# EAGLE design turbo_B (EAGLE 6.5.0)

## Sheet 1 of 3: Shield
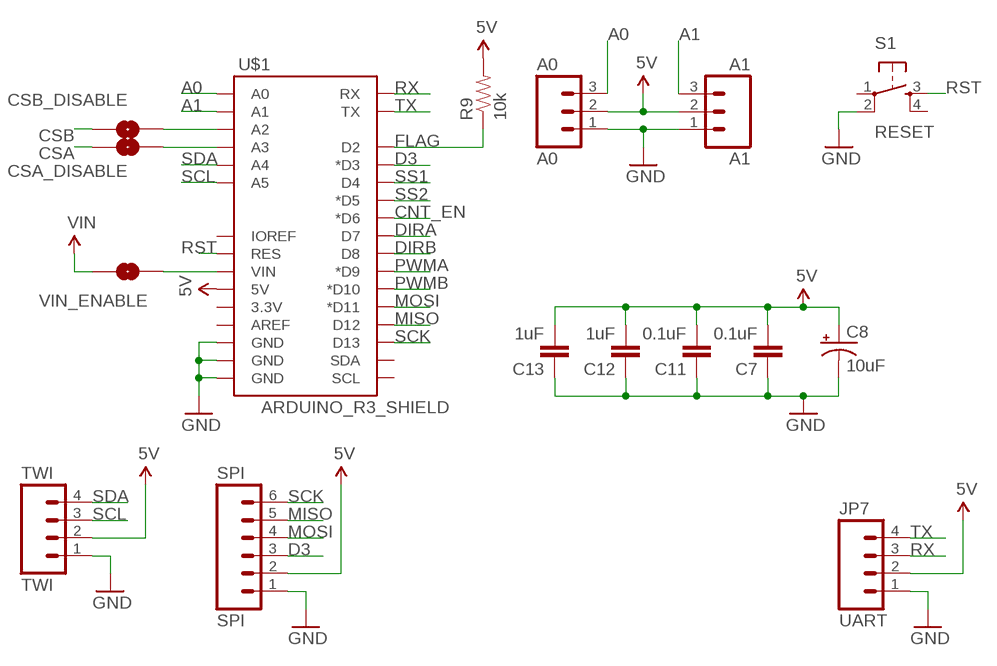
[diagram p0: schematic, sheet 1]

### Parts
A0  A0  M03LOCK  [1X03_LOCK]
A1  A1  M03LOCK  [1X03_LOCK]
C7  0.1uF  CAP0603-CAP  [0603-CAP]
C8  10uF  CAP_POLC  [PANASONIC_C]
C11  0.1uF  CAP0603-CAP  [0603-CAP]
C12  1uF  CAP0603-CAP  [0603-CAP]
C13  1uF  CAP0603-CAP  [0603-CAP]
CSA_DISABLE  SOLDERJUMPERTRACE  [SJ_2S-TRACE]
CSB_DISABLE  SOLDERJUMPERTRACE  [SJ_2S-TRACE]
JP7  UART  M04LOCK  [1X04_LOCK]
R9  10k  RESISTOR0603-RES  [0603-RES]
S1  RESET  TAC_SWITCHSMD  [TACTILE_SWITCH_SMD]
SPI  SPI  M06LOCK  [1X06_LOCK]
TWI  TWI  M04LOCK  [1X04_LOCK]
U$1  ARDUINO_R3_SHIELD  [UNO_R3_SHIELD]
VIN_ENABLE  SOLDERJUMPERNO  [SJ_2S-NO]

### Nets
5V: A0.2 A1.2 C7.2 C8.+ C11.2 C12.2 C13.2 JP7.2 R9.2 SPI.2 TWI.2 U$1.5V ; also sheet 2,3
A0: A0.3 U$1.A0
A1: A1.3 U$1.A1
CNT_EN: U$1.D6(*D6) ; also sheet 2
CSA: CSA_DISABLE.2 ; also sheet 3
CSB: CSB_DISABLE.2 ; also sheet 3
D3: SPI.3 U$1.D3(*D3)
DIRA: U$1.D7 ; also sheet 3
DIRB: U$1.D8 ; also sheet 3
FLAG: R9.1 U$1.D2 ; also sheet 2
GND: A0.1 A1.1 C7.1 C8.- C11.1 C12.1 C13.1 JP7.1 S1.2 SPI.1 TWI.1 U$1.GND@0(GND) U$1.GND@1(GND) U$1.GND@2(GND) ; also sheet 2,3
MISO: SPI.5 U$1.D12 ; also sheet 2
MOSI: SPI.4 U$1.D11(*D11) ; also sheet 2
N$7: CSB_DISABLE.1 U$1.A2
N$11: CSA_DISABLE.1 U$1.A3
N$13: U$1.VIN VIN_ENABLE.2
PWMA: U$1.D9(*D9) ; also sheet 3
PWMB: U$1.D10(*D10) ; also sheet 3
RST: S1.3 U$1.RES
RX: JP7.3 U$1.RX
SCK: SPI.6 U$1.D13 ; also sheet 2
SCL: TWI.3 U$1.A5
SDA: TWI.4 U$1.A4
SS1: U$1.D4 ; also sheet 2
SS2: U$1.D5(*D5) ; also sheet 2
TX: JP7.4 U$1.TX
VIN: VIN_ENABLE.1 ; also sheet 3
Unconnected: S1.1 S1.4 U$1.3.3V U$1.AREF U$1.IOREF U$1.SCL U$1.SDA

## Sheet 2 of 3: Encoder Counters
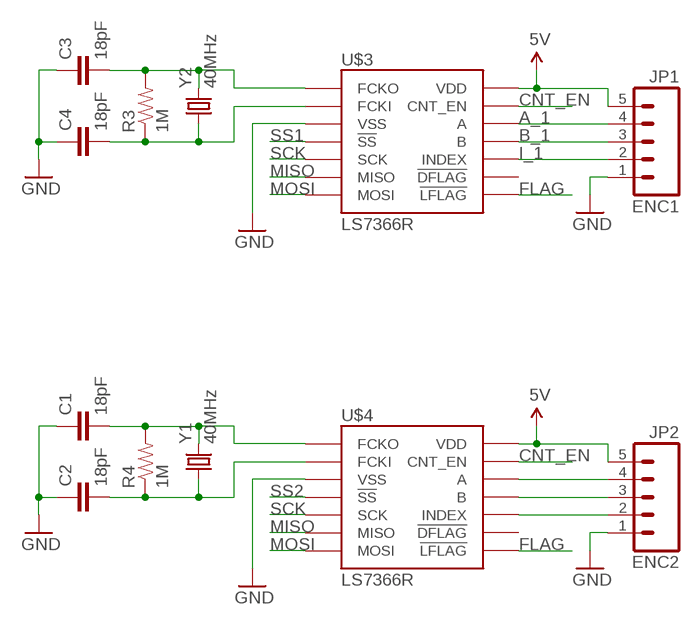
[diagram p1: schematic, sheet 2]

### Parts
C1  18pF  CAP0603-CAP  [0603-CAP]
C2  18pF  CAP0603-CAP  [0603-CAP]
C3  18pF  CAP0603-CAP  [0603-CAP]
C4  18pF  CAP0603-CAP  [0603-CAP]
JP1  ENC1  M05LOCK  [1X05_LOCK]
JP2  ENC2  M05LOCK  [1X05_LOCK]
R3  1M  RESISTOR0603-RES  [0603-RES]
R4  1M  RESISTOR0603-RES  [0603-RES]
U$3  LS7366R  [SOIC14]
U$4  LS7366R  [SOIC14]
Y1  40MHz  CRYSTAL5X3  [CRYSTAL-SMD-5X3]
Y2  40MHz  CRYSTAL5X3  [CRYSTAL-SMD-5X3]

### Nets
5V: JP1.5 JP2.5 U$3.14(VDD) U$4.14(VDD) ; also sheet 1,3
A_1: JP1.4 U$3.12(A)
B_1: JP1.3 U$3.11(B)
CNT_EN: U$3.13(CNT_EN) U$4.13(CNT_EN) ; also sheet 1
FLAG: U$3.8(!LFLAG) U$4.8(!LFLAG) ; also sheet 1
GND: C1.1 C2.1 C3.1 C4.1 JP1.1 JP2.1 U$3.3(VSS) U$4.3(VSS) ; also sheet 1,3
I_1: JP1.2 U$3.10(INDEX)
MISO: U$3.6(MISO) U$4.6(MISO) ; also sheet 1
MOSI: U$3.7(MOSI) U$4.7(MOSI) ; also sheet 1
N$1: C3.2 R3.2 U$3.1(FCKO) Y2.3
N$2: C4.2 R3.1 U$3.2(FCKI) Y2.1
N$3: JP2.4 U$4.12(A)
N$4: JP2.3 U$4.11(B)
N$5: JP2.2 U$4.10(INDEX)
N$9: C1.2 R4.2 U$4.1(FCKO) Y1.3
N$10: C2.2 R4.1 U$4.2(FCKI) Y1.1
SCK: U$3.5(SCK) U$4.5(SCK) ; also sheet 1
SS1: U$3.4(!SS) ; also sheet 1
SS2: U$4.4(!SS) ; also sheet 1
Unconnected: U$3.9(!DFLAG) U$4.9(!DFLAG)

## Sheet 3 of 3: Motor Driver
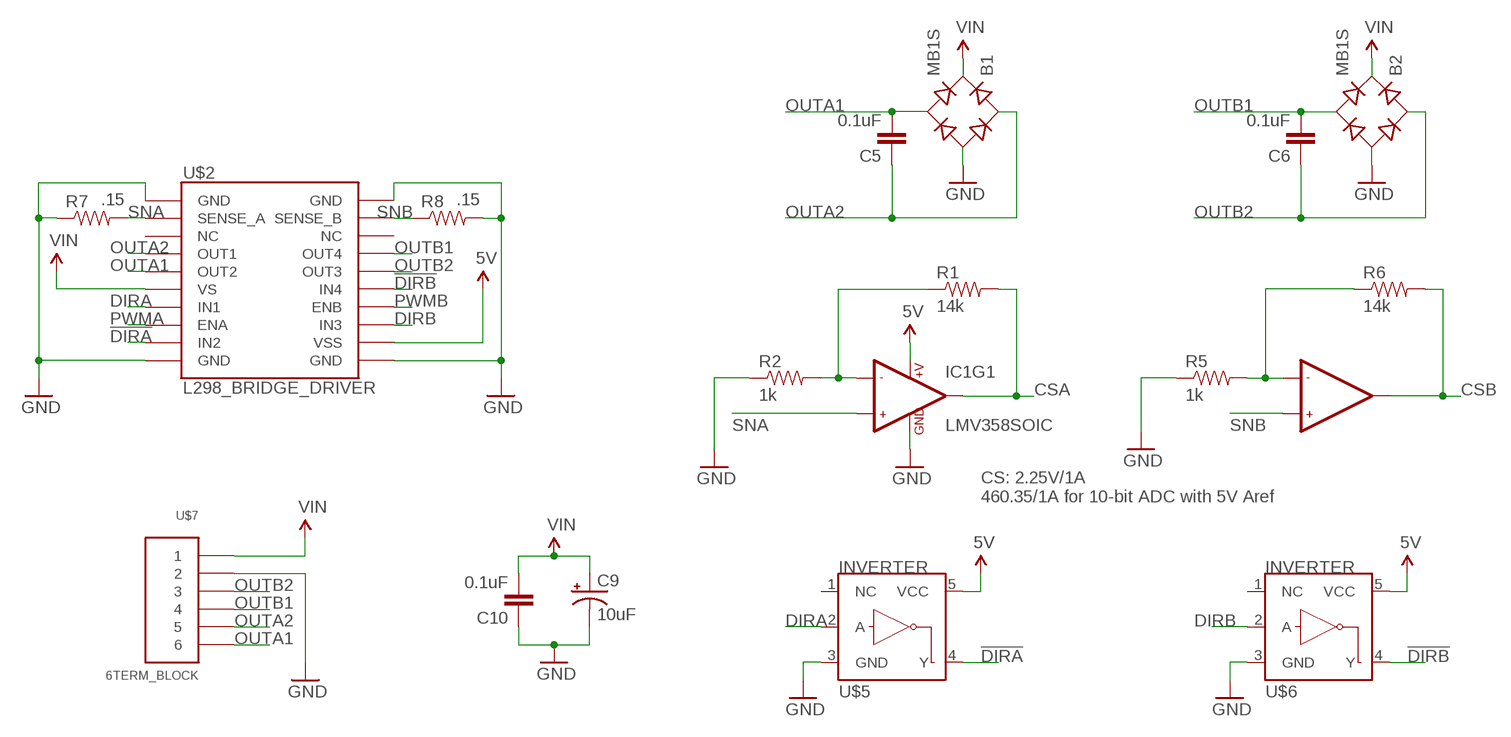
[diagram p2: schematic, sheet 3]

### Parts
B1  MB1S  [SOIC-4]
B2  MB1S  [SOIC-4]
C5  0.1uF  CAP0603-CAP  [0603-CAP]
C6  0.1uF  CAP0603-CAP  [0603-CAP]
C9  10uF  CAP_POLC  [PANASONIC_C]
C10  0.1uF  CAP0603-CAP  [0603-CAP]
IC1  LMV358SOIC  [SO08]
R1  14k  RESISTOR0603-RES  [0603-RES]
R2  1k  RESISTOR0603-RES  [0603-RES]
R5  1k  RESISTOR0603-RES  [0603-RES]
R6  14k  RESISTOR0603-RES  [0603-RES]
R7  .15  RESISTOR1206  [1206]
R8  .15  RESISTOR1206  [1206]
U$2  L298_BRIDGE_DRIVER  [POWERSO20]
U$5  INVERTER  [SOT23-5]
U$6  INVERTER  [SOT23-5]
U$7  6TERM_BLOCK  [6TERM_BLOCK]

### Nets
5V: IC1.8(+V) U$2.12(VSS) U$5.5(VCC) U$6.5(VCC) ; also sheet 1,2
!DIRA: U$2.9(IN2) U$5.4(Y)
!DIRB: U$2.15(IN4) U$6.4(Y)
CSA: IC1.1(OUT1) R1.2 ; also sheet 1
CSB: IC1.7(OUT2) R6.2 ; also sheet 1
DIRA: U$2.7(IN1) U$5.2(A) ; also sheet 1
DIRB: U$2.13(IN3) U$6.2(A) ; also sheet 1
GND: B1.- B2.- C9.- C10.1 IC1.4(GND) R2.1 R5.1 R7.1 R8.2 U$2.1(GND) U$2.10(GND) U$2.11(GND) U$2.20(GND) U$2.P$1(GND) U$5.3(GND) U$6.3(GND) U$7.P$2 ; also sheet 1,2
N$6: IC1.6(-IN2) R5.2 R6.1
N$12: IC1.2(-IN1) R1.1 R2.2
OUTA1: B1.~2(AC2) C5.2 U$2.5(OUT2) U$7.P$6
OUTA2: B1.~1(AC1) C5.1 U$2.4(OUT1) U$7.P$5
OUTB1: B2.~2(AC2) C6.2 U$2.17(OUT4) U$7.P$4
OUTB2: B2.~1(AC1) C6.1 U$2.16(OUT3) U$7.P$3
PWMA: U$2.8(ENA) ; also sheet 1
PWMB: U$2.14(ENB) ; also sheet 1
SNA: IC1.3(+IN1) R7.2 U$2.2(SENSE_A)
SNB: IC1.5(+IN2) R8.1 U$2.19(SENSE_B)
VIN: B1.+ B2.+ C9.+ C10.2 U$2.6(VS) U$7.P$1 ; also sheet 1
Unconnected: U$2.3(NC) U$2.18(NC) U$5.1(NC) U$6.1(NC)

### Notes on the sheet
- CS: 2.25V/1A
  460.35/1A for 10-bit ADC with 5V Aref

## Library data of the parts
A0 A1 = SparkFun-Connectors:M03: Header 3 Standard 3-pin 0.1" header. Use with straight break away headers (SKU : PRT-00116), right angle break away headers (PRT-00553), swiss pins (PRT-00743), machine pins (PRT-00117), and female headers (PRT-00115). Molex polarized connector foot print use with SKU : PRT-08232 with associated crimp pins and housings.
B1 B2 = rectifier:MB*S: Bridge Rectifier Source: http://www.fairchildsemi.com/ds/MB/MB6S.pdf
C1-C7 C10-C13 = SparkFun-Passives:CAP: Capacitor Standard 0603 ceramic capacitor, and 0.1" leaded capacitor.
C8 C9 = SparkFun-Capacitors:CAP_POL: Capacitor Polarized These are standard SMD and PTH capacitors. Normally 10uF, 47uF, and 100uF in electrolytic and tantalum varieties. Always verify the external diameter of the through hole cap, it varies with capacity, voltage, and manufacturer. The EIA devices should be standard.
CSA_DISABLE CSB_DISABLE VIN_ENABLE = SparkFun-Passives:SOLDERJUMPER: Solder Jumper Standard SMD solder jumper. Used to automate production. Two varients : Normally Open and Normally Closed are the same, but have different paste layers. NC will have a large amount of paste and should jumper during reflow.
IC1 = SparkFun-AnalogIC:LMV358: Jellybean rail-to-rail output op-amp; PROD_ID: IC-09657
JP1 JP2 = SparkFun-Connectors:M05: Header 5 Standard 5-pin 0.1" header. Use with straight break away headers (SKU : PRT-00116), right angle break away headers (PRT-00553), swiss pins (PRT-00743), machine pins (PRT-00117), and female headers (PRT-00115). Molex polarized connector foot print use with SKU : PRT-08230 with associated crimp pins and housings.
JP7 TWI = SparkFun-Connectors:M04: Header 4 Standard 4-pin 0.1" header. Use with straight break away headers (SKU : PRT-00116), right angle break away headers (PRT-00553), swiss pins (PRT-00743), machine pins (PRT-00117), and female headers (PRT-00115). Molex polarized connector foot print use with SKU : PRT-08231 with associated crimp pins and housings. 1MM SMD Version SKU: PRT-10208
R1-R6 R9 = SparkFun-Passives:RESISTOR: Resistor Basic schematic elements and footprints for 0603, 1206, and PTH resistors.
R7 R8 = SparkFun-Resistors:RESISTOR: Resistor Basic schematic elements and footprints for 0603, 1206, and PTH resistors.
S1 = SparkFun-Electromechanical:TAC_SWITCH: Momentary Switch Button commonly used for reset or general input. Spark Fun Electronics SKU : COM-00097 SMT- SWCH-08247; PROD_ID: SWCH-08247
SPI = SparkFun-Connectors:M06: Header 6 Standard 6-pin 0.1" header. Use with straight break away headers (SKU : PRT-00116), right angle break away headers (PRT-00553), swiss pins (PRT-00743), machine pins (PRT-00117), and female headers (PRT-00115). Molex polarized connector foot print use with SKU : PRT-08094 with associated crimp pins and housings. NOTES ON THE VARIANTS LOCK and LOCK_LONGPADS... This footprint was designed to help hold the alignment of a through-hole component (i.e. 6-pin header) while soldering it into place. You may notice that each hole has been shifted either up or down by 0.005 of an inch from it's more standard position (which is a perfectly straight line). This slight alteration caused the pins (the squares in the middle) to touch the edges of the holes. Because they are alternating, it causes a "brace" to hold the component in place. 0.005 has proven to be the perfect amount of "off-center" position when using our standard breakaway headers. Although looks a little odd when you look at the bare footprint, once you have a header in there, the alteration is very hard to notice. Also,if you push a header all the way into place, it is covered up entirely on the bottom side. This idea of altering the position of holes to aid alignment will be further integrated into the Sparkfun Library for other footprints. It can help hold any component with 3 or more connection pins.
U$1 = SparkFun-Boards:ARDUINO_R3_SHIELD: Shield form compatible with the Arduino Uno R3.
U$2 = SparkFun-PowerIC:L298_BRIDGE_DRIVER: Full-bridge power driver IC
U$3 U$4 = dCustom:LS7366R
U$5 U$6 = SparkFun-DigitalIC:INVERTER: Single inverter, SOT23-5
U$7 = dCustom:6TERM_BLOCK: On Shore Technology Inc 6x1 Screw Terminal Block with 2.54mm pin spacing acceting 20-30 AWG wire. Digikey Part No: ED10565-ND http://www.digikey.com/product-detail/en/OSTVN06A150/ED10565-ND/1588866
Y1 Y2 = SparkFun-FreqCtrl:CRYSTAL: Various standard crystals. Proven footprints. Spark Fun Electronics SKU : COM-00534

## Board
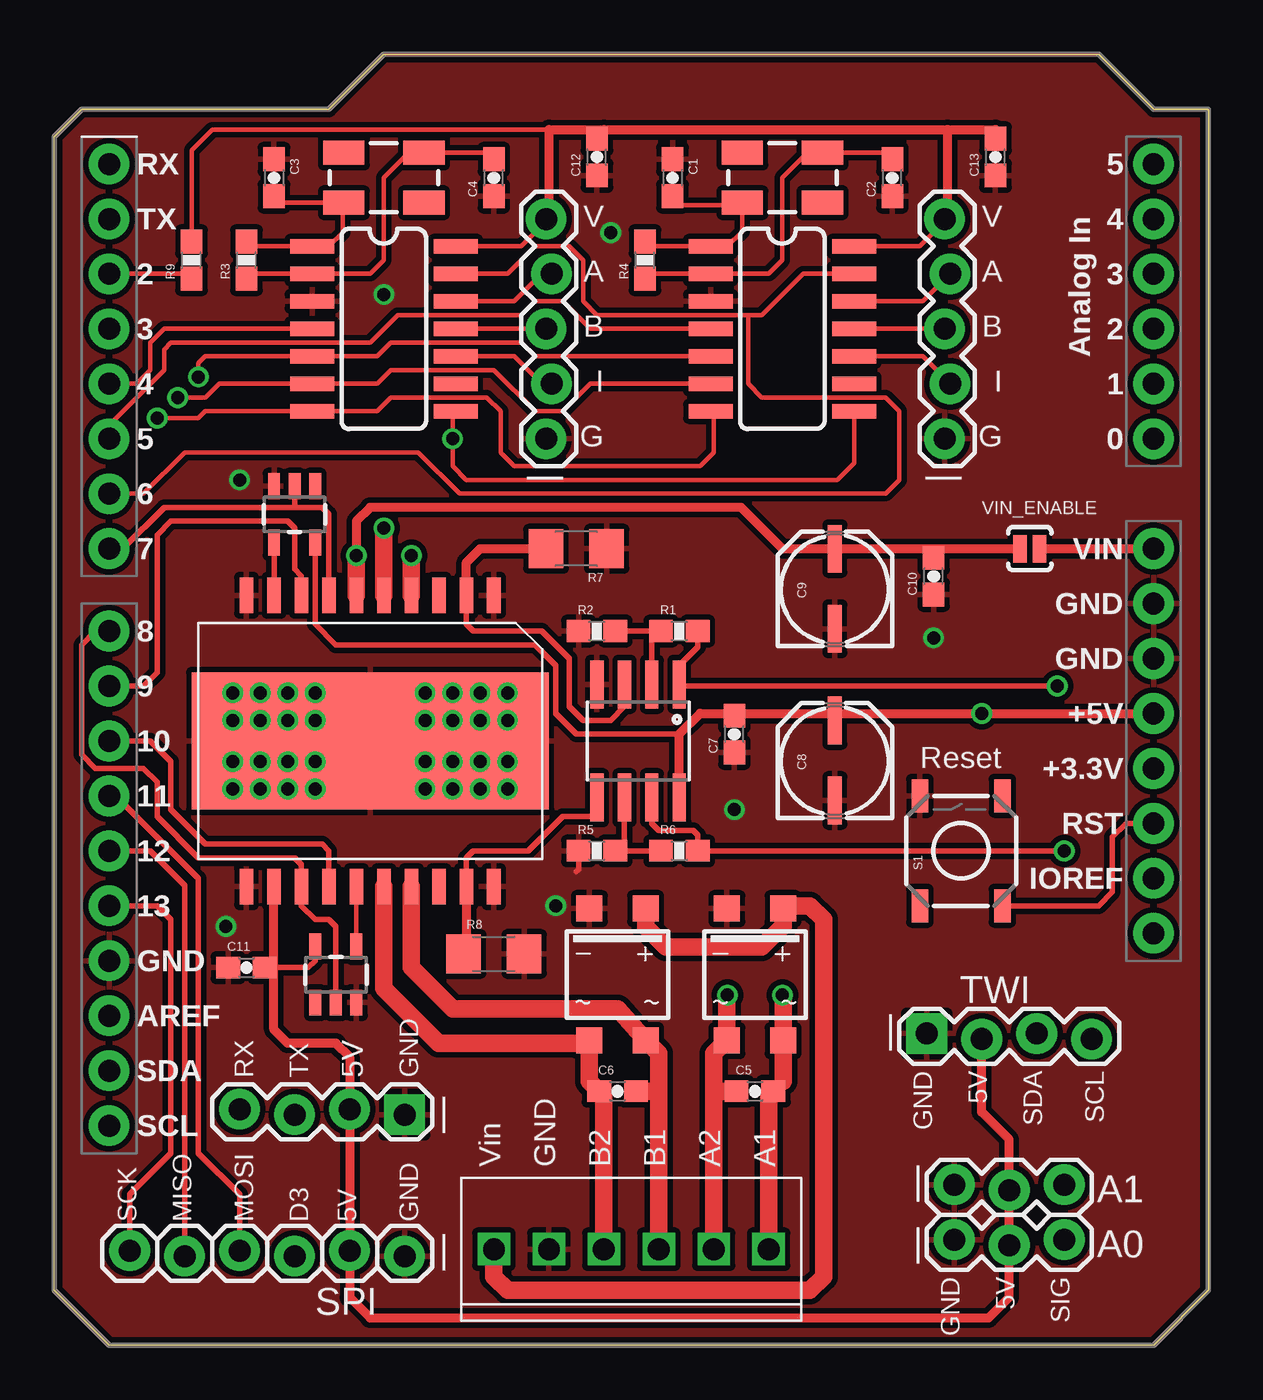
[diagram p3: board, top side]
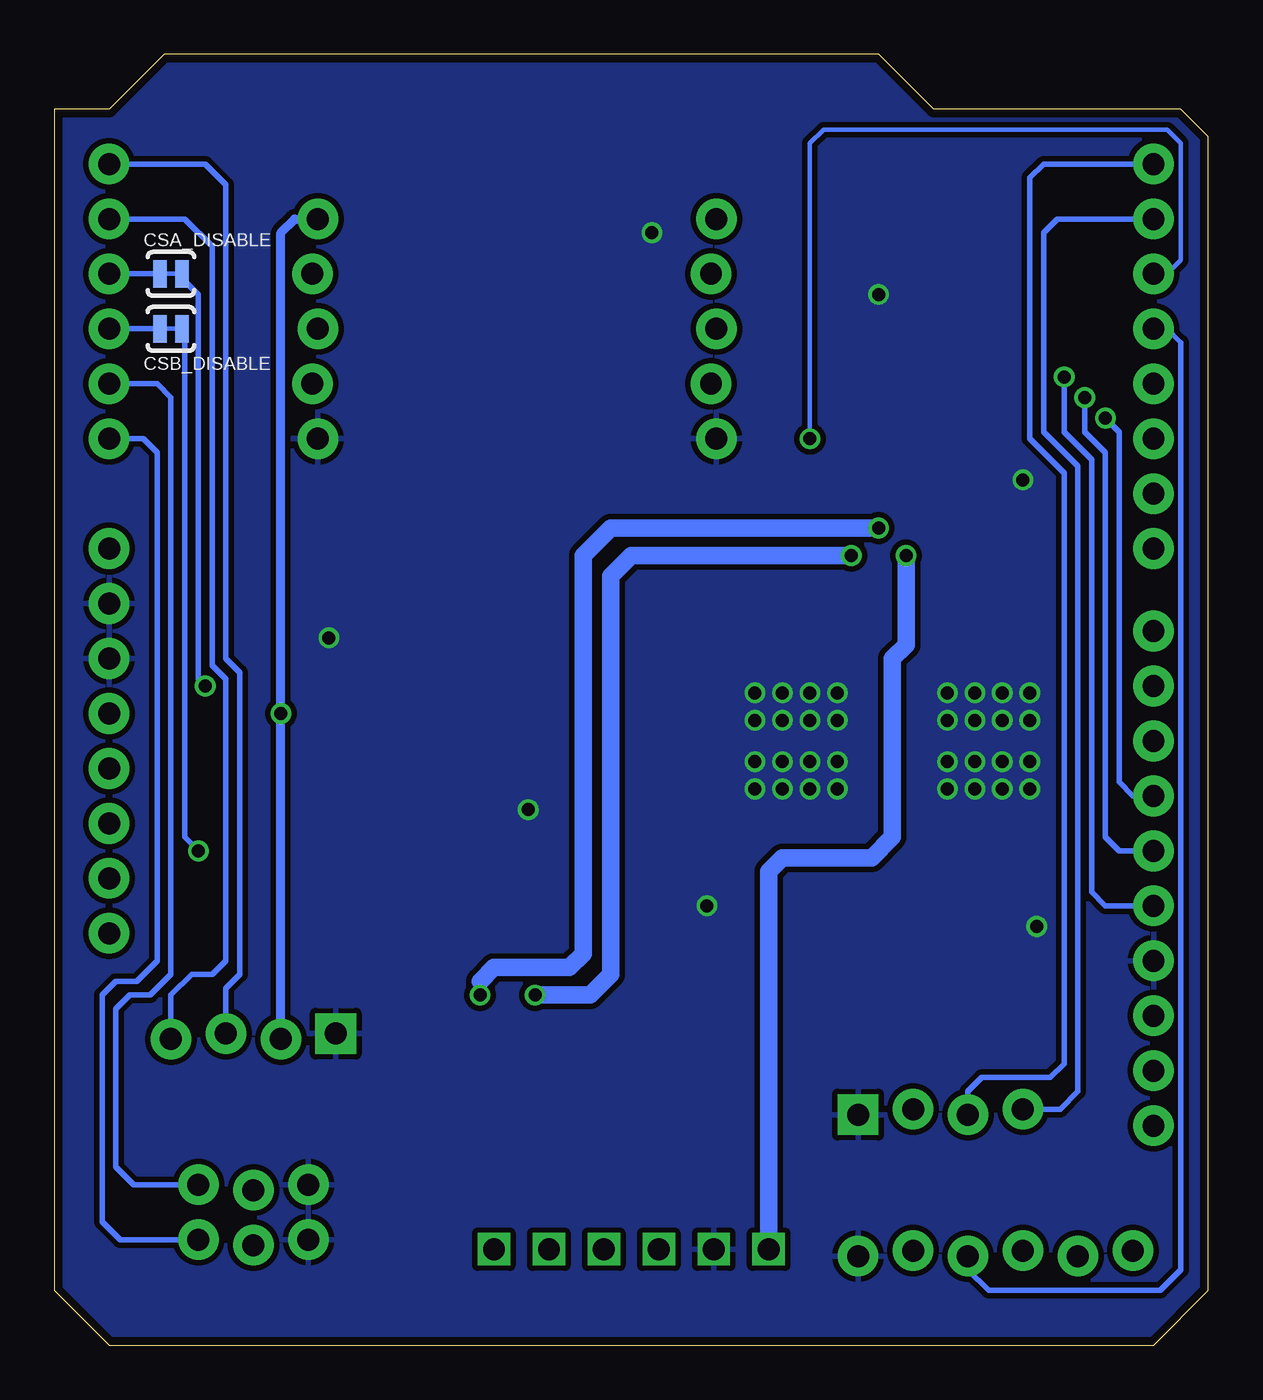
[diagram p4: board, bottom side, seen from below]

Size 53.34 x 59.69 mm. Coordinates in mm from the lower left corner, seen from the top.
Outline: 0,2.54 0,55.88 1.27,57.15 12.7,57.15 15.24,59.69 48.26,59.69 50.8,57.15 53.34,57.15 53.34,2.54 50.8,0 2.54,0 0,2.54
Copper layers (1*16): Top 0.0356mm / dielectric 1.5011mm / Bottom 0.0356mm
Design rules "oshPark": minimum track width 6mil, minimum drill 13mil, track to track 6mil, track to pad 6mil, pad to pad 6mil, via to via 6mil, smd to smd 6mil, copper to edge 15mil, drill to drill 6mil, minimum pad ring 7mil, minimum via ring 7mil, stop-mask expansion 3mil, vias tented up to drill 0mil, thermal gap 10mil

### Footprints (pad centres in the part's own frame; a part is rotated, then mirrored left to right if it is on the bottom)
1X03_LOCK = drill 1.016 pad 1.88: 1 0,0.127; 2 2.54,-0.127; 3 5.08,0.127
SOIC-4 = smd 1.2 x 1.2: + 1.3,3.05; - -1.3,3.05; ~1 -1.3,-3.05; ~2 1.3,-3.05
0603-CAP = smd 1.1 x 1: 1 -0.85,0; 2 0.85,0
PANASONIC_C = smd 2.2 x 0.65: + 1.9,-0.2; - -1.8,-0.2
SJ_2S-TRACE = smd 0.635 x 1.27: 1 -0.508,0; 2 0.508,0
SO08 = smd 0.61 x 2.21: 1 -1.905,-2.616; 2 -0.635,-2.616; 3 0.635,-2.616; 4 1.905,-2.616; 5 1.905,2.616; 6 0.635,2.616; 7 -0.635,2.616; 8 -1.905,2.616
1X05_LOCK = drill 1.016 pad 1.88: 1 0,0.127; 2 2.54,-0.127; 3 5.08,0.127; 4 7.62,-0.127; 5 10.16,0.127
1X04_LOCK = drill 1.016 pad 1.88 square: 1 0,0.127 | drill 1.016 pad 1.88: 2 2.54,-0.127; 3 5.08,0.127; 4 7.62,-0.127
0603-RES = smd 1.1 x 1: 1 -0.85,0; 2 0.85,0
1206 = smd 1.6 x 1.8: 1 -1.4,0; 2 1.4,0
TACTILE_SWITCH_SMD = smd 1.524 x 0.762: 1 -2.54,1.905; 2 2.54,1.905; 3 -2.54,-1.905; 4 2.54,-1.905
1X06_LOCK = drill 1.016 pad 1.88: 1 0,0; 2 2.54,-0.254; 3 5.08,0; 4 7.62,-0.254; 5 10.16,0; 6 12.7,-0.254
UNO_R3_SHIELD = drill 1.016 pad 1.88: 3.3V 50.8,26.67; 5V 50.8,29.21; A0 50.8,41.91; A1 50.8,44.45; A2 50.8,46.99; A3 50.8,49.53; A4 50.8,52.07; A5 50.8,54.61; AREF 2.54,15.24; D2 2.54,49.53; D3 2.54,46.99; D4 2.54,44.45; D5 2.54,41.91; D6 2.54,39.37; D7 2.54,36.83; D8 2.54,33.02; D9 2.54,30.48; D10 2.54,27.94; D11 2.54,25.4; D12 2.54,22.86; D13 2.54,20.32; GND@0 50.8,31.75; GND@1 50.8,34.29; GND@2 2.54,17.78; IOREF 50.8,21.59; NC 50.8,19.05; RES 50.8,24.13; RX 2.54,54.61; SCL 2.54,10.16; SDA 2.54,12.7; TX 2.54,52.07; VIN 50.8,36.83
POWERSO20 = smd 1.651 x 0.635: 1 -6.731,5.715; 2 -6.731,4.445; 3 -6.731,3.175; 4 -6.731,1.905; 5 -6.731,0.635; 6 -6.731,-0.635; 7 -6.731,-1.905; 8 -6.731,-3.175; 9 -6.731,-4.445; 10 -6.731,-5.715; 11 6.731,-5.715; 12 6.731,-4.445; 13 6.731,-3.175; 14 6.731,-1.905; 15 6.731,-0.635; 16 6.731,0.635; 17 6.731,1.905; 18 6.731,3.175; 19 6.731,4.445; 20 6.731,5.715 | smd 6.35 x 16.51: P$1 0,0
SOIC14 = smd 2.032 x 0.66: 1 -3.315,4.445; 2 -3.315,3.175; 3 -3.315,1.905; 4 -3.315,0.635; 5 -3.315,-0.635; 6 -3.315,-1.905; 7 -3.315,-3.175; 8 3.315,-3.175; 9 3.315,-1.905; 10 3.315,-0.635; 11 3.315,0.635; 12 3.315,1.905; 13 3.315,3.175; 14 3.315,4.445
SOT23-5 = smd 0.55 x 1.2: 1 -0.95,-1.3; 2 0,-1.3; 3 0.95,-1.3; 4 0.95,1.3; 5 -0.95,1.3
6TERM_BLOCK = drill 1 square: P$1 0,0; P$2 2.54,0; P$3 5.08,0; P$4 7.62,0; P$5 10.16,0; P$6 12.7,0
SJ_2S-NO = smd 0.635 x 1.27: 1 -0.45,0; 2 0.45,0
CRYSTAL-SMD-5X3 = smd 1.9 x 1.1: 1 -1.85,-1.15; 2 1.85,-1.15; 3 1.85,1.15; 4 -1.85,1.15

### Placement (x,y rotation side)
A0  41.59,4.76 0 top
A1  41.59,7.3 0 top
B1  32.38,17.14 0 top
B2  26.04,17.14 0 top
C1  28.57,53.98 270 top
C2  38.73,53.98 90 top
C3  10.16,53.98 270 top
C4  20.32,53.98 90 top
C5  32.38,11.75 0 top
C6  26.04,11.75 0 top
C7  31.43,28.26 90 top
C8  35.88,26.99 90 top
C9  35.88,34.92 90 top
C10  40.64,35.56 90 top
C11  8.89,17.46 0 top
C12  25.08,54.93 90 top
C13  43.5,54.93 90 top
CSA_DISABLE  47.94,49.53 0 bottom
CSB_DISABLE  47.94,46.99 0 bottom
IC1  26.99,27.94 180 top
JP1  22.86,41.91 90 top
JP2  41.27,41.91 90 top
JP7  16.19,10.79 180 top
R1  28.89,33.02 0 top
R2  25.08,33.02 0 top
R3  8.89,50.16 90 top
R4  27.3,50.16 90 top
R5  25.08,22.86 0 top
R6  28.89,22.86 0 top
R7  24.13,36.83 180 top
R8  20.32,18.1 0 top
R9  6.35,50.16 90 top
S1  41.91,22.86 90 top
SPI  16.19,4.13 180 top
TWI  40.32,14.29 0 top
U$1  0,0 0 top
U$2  14.61,27.94 270 top
U$3  15.24,46.35 0 top
U$4  33.66,46.35 0 top
U$5  11.11,38.42 180 top
U$6  13.02,17.14 0 top
U$7  20.32,4.45 0 top
VIN_ENABLE  45.09,36.83 0 top
Y1  33.66,53.98 180 top
Y2  15.24,53.98 180 top

### Tracks (layer width: path | path; a pad name or v marks a point on that pad's centre or on a via)
5V  (via drill 0.6)
  Top 0.203: JP1.5 22.73,51.94 21.59,50.8 U$3.14 | JP2.5 41.15,51.94 40.01,50.8 U$4.14 | R9.2 6.35,55.24 7.3,56.2 22.86,56.2 | C13.2 43.5,56.2 | C12.2 25.4,56.2
  Top 0.254: U$5.5 12.06,33.34 13.02,32.38 22.23,32.38 23.18,31.43 23.18,29.21 24.13,28.26 28.89,28.26 | U$6.5 12.07,17.78 11.75,17.46 10.16,17.46 C11.2 | C8.+ 36.08,29.09 36.2,29.21 | C7.2 31.11,29.21
  Top 0.305: 41.27,52.2 JP2.5 | 22.86,52.2 JP1.5
  Top 0.406: 41.27,56.2 25.4,56.2 22.86,56.2 22.86,52.2 | 41.27,56.2 43.5,56.2 | 41.27,56.2 41.27,52.2 | IC1.8 28.89,28.26 29.84,29.21 31.11,29.21 36.2,29.21 v42.86,29.21 U$1.5V | TWI.2 42.86,10.79 44.13,9.53 A1.2 A0.2 44.13,2.22 43.18,1.27 14.61,1.27 13.65,2.22 SPI.2 JP7.2 13.65,13.34 13.02,13.97 10.79,13.97 10.16,14.61 10.16,17.46 U$2.12
  Bottom 0.406: TWI.2 v42.86,29.21 42.86,51.44 42.23,52.07 JP2.5
!DIRA
  Top 0.203: U$2.9
  Top 0.254: U$5.4 U$2.9
!DIRB
  Top 0.203: U$2.15 U$6.4
A0
  Bottom 0.254: U$1.A0 49.21,41.91 48.58,41.27 48.58,17.78 49.53,16.83 50.48,16.83 51.12,16.19 51.12,5.71 50.29,4.89 A0.3
A1
  Bottom 0.254: U$1.A1 48.58,44.45 47.94,43.81 47.94,17.14 48.9,16.19 49.85,16.19 50.48,15.56 50.48,8.26 49.66,7.43 A1.3
A_1
  Top 0.203: U$3.12 21.27,48.26 22.54,49.53 JP1.4
B_1
  Top 0.203: U$3.11 JP1.3
CNT_EN
  Top 0.203: U$3.13 20.95,49.53 22.23,50.8 23.81,50.8 24.45,50.16 24.45,48.26 25.08,47.62 32.07,47.62 | 32.07,47.62 32.7,47.62 34.61,49.53 U$4.13 | U$1.D6 4.13,39.37 6.03,41.27 16.83,41.27 18.73,39.37 38.42,39.37 39.05,40.01 39.05,43.18 38.42,43.81 32.7,43.81 32.07,44.45 32.07,47.62
CSA  (via drill 0.6)
  Top 0.203: 28.97,30.48 IC1.1 28.89,31.43
  Top 0.254: 28.97,30.48 v46.35,30.48 | R1.2 29.74,32.28 28.89,31.43
  Bottom 0.203: CSA_DISABLE.2 47.43,49.34
  Bottom 0.254: 47.43,49.34 46.67,48.58 46.67,30.8 v46.35,30.48
CSB  (via drill 0.6)
  Top 0.254: IC1.7 27.62,24.13 27.94,23.81 29.53,23.81 29.74,23.6 R6.2 v46.67,22.86
  Bottom 0.203: 47.31,46.8 CSB_DISABLE.2
  Bottom 0.254: v46.67,22.86 47.31,23.5 47.31,46.8
D3
  Bottom 0.203: 1.27,46.35 1.91,46.99 U$1.D3
  Bottom 0.254: SPI.3 11.11,3.49 10.16,2.54 2.22,2.54 1.27,3.49 1.27,46.35
DIRA
  Top 0.254: U$2.7 12.7,38.42 12.38,38.73 11.11,38.73 | 11.11,38.73 U$5.2 | 11.11,38.73 5.08,38.73 3.17,36.83 U$1.D7
DIRB
  Top 0.254: U$1.D8 1.91,33.02 1.27,32.38 1.27,27.3 1.91,26.67 4.13,26.67 4.76,26.04 4.76,24.45 6.67,22.54 11.11,22.54 11.43,22.23 U$2.13 11.43,20.32 12.06,19.68 12.7,19.68 13.02,19.37 U$6.2
FLAG  (via drill 0.6)
  Top 0.203: R9.1 6.13,49.53 U$1.D2 6.35,49.53 R9.1 | R9.1 6.35,48.9 | U$4.8 36.97,40.78 36.2,40.01 19.05,40.01 18.41,40.64 v18.41,41.91 18.41,43.04 U$3.8
  Bottom 0.203: v18.41,41.91 18.41,55.56 17.78,56.2 1.91,56.2 1.27,55.56 1.27,50.16 1.91,49.53 U$1.D2
GND  (via drill 0.6)
  Top 0.254: R5.1 24.23,22.01 24.13,21.91
  Top 0.406: U$2.P$1 12.06,27.94 v12.06,26.99
  other vias: 25.72,51.44 15.24,48.58 8.26,25.72 8.26,30.16 8.26,26.99 8.26,28.89 9.53,25.72 9.53,30.16 9.53,26.99 9.53,28.89 10.79,25.72 10.79,30.16 10.79,26.99 10.79,28.89 12.06,25.72 12.06,30.16 12.06,28.89 17.14,25.72 17.14,30.16 17.14,26.99 17.14,28.89 18.41,25.72 18.41,30.16 18.41,26.99 18.41,28.89 19.68,25.72 19.68,30.16 19.68,26.99 19.68,28.89 20.95,25.72 20.95,30.16 20.95,26.99 20.95,28.89 23.18,20.32 8.57,40.01 7.94,19.37 31.43,24.77 40.64,32.7
  pour Top (isolate 0.254, rank 6): 0,59.69 53.34,59.69 53.34,0 0,0
  pour Bottom (isolate 0.254, rank 6): -0.32,60.01 53.66,60.01 53.66,-0.32 -0.32,-0.32
I_1
  Top 0.203: U$3.10 21.27,45.72 22.54,44.45 JP1.2
MISO  (via drill 0.6)
  Top 0.203: U$4.6 24.77,44.45 23.5,43.18 22.23,43.18 20.32,45.09 15.56,45.09 14.92,44.45 U$3.6 7.62,44.45 6.99,43.81 v5.71,43.81
  Top 0.254: SPI.5 6.03,21.27 4.45,22.86 U$1.D12
  Bottom 0.254: U$1.D12 4.13,22.86 4.76,23.5 4.76,41.27 5.71,42.23 v5.71,43.81
MOSI  (via drill 0.6)
  Top 0.203: U$4.7 30.48,43.04 30.48,41.27 29.84,40.64 21.27,40.64 20.64,41.27 20.64,43.18 20,43.81 15.56,43.81 14.92,43.18 U$3.7 6.99,43.18 6.67,42.86 v4.76,42.86
  Top 0.254: U$1.D11 2.86,25.4 6.67,21.59 6.67,8.89 8.57,6.99 SPI.4
  Bottom 0.254: U$1.D11 3.49,25.4 4.13,26.04 4.13,42.23 v4.76,42.86
N$1
  Top 0.203: R3.2 9.11,50.8 U$3.1 12.7,50.8 13.34,51.44 13.34,52.7 13.21,52.83 | Y2.3 13.21,52.83 | C3.2 10.46,52.83 13.21,52.83
N$2
  Top 0.203: C4.2 20.02,55.12 Y2.1 16.39,55.12 15.24,53.98 15.24,50.16 14.61,49.53 U$3.2 9.11,49.53 R3.1
N$3
  Top 0.203: U$4.12 40.13,48.26 JP2.4
N$4
  Top 0.203: U$4.11 JP2.3
N$5
  Top 0.203: U$4.10 40.13,45.72 JP2.2
N$6
  Top 0.203: 26.35,23.28 R5.2
  Top 0.254: IC1.6 26.35,23.28 | R6.1 R5.2
N$7
  Bottom 0.254: U$1.A2 CSB_DISABLE.1
N$9
  Top 0.203: R4.2 27.52,50.8 U$4.1 31.11,50.8 31.8,51.49 Y1.3 31.68,52.7 28.57,52.7 C1.2
N$10
  Top 0.203: C2.2 38.44,55.12 Y1.1 34.8,55.12 33.66,53.98 33.66,50.16 33.02,49.53 U$4.2 27.52,49.53 R4.1
N$11
  Bottom 0.254: U$1.A3 CSA_DISABLE.1
N$12
  Top 0.203: 27.62,32.6 R1.1
  Top 0.254: R2.2 R1.1 | IC1.2 27.62,32.6
N$13
  Top 0.406: VIN_ENABLE.2 U$1.VIN
OUTA1  (via drill 0.6)
  Top 0.305: 33.69,16.16 v33.66,16.19
  Top 0.406: 33.69,12.2 C5.2
  Top 0.813: U$7.P$6 33.02,11.53 C5.2 | 33.69,12.2 B1.~2 33.69,16.16 | U$2.5 v15.24,37.78
  Bottom 0.406: v33.66,16.19 33.66,16.83
  Bottom 0.813: 33.66,16.83 33.02,17.46 29.53,17.46 28.89,18.1 28.89,36.51 27.62,37.78 v15.24,37.78
OUTA2  (via drill 0.6)
  Top 0.305: 31.09,16.16 v31.11,16.19
  Top 0.813: 31.09,16.16 B1.~1 30.48,13.49 30.48,11.75 | U$2.4 v16.51,36.51 | U$7.P$5 30.48,11.75 | C5.1 30.48,11.75
  Bottom 0.813: v16.51,36.51 26.67,36.51 27.62,35.56 27.62,17.14 28.57,16.19 v31.11,16.19
OUTB1
  Top 0.813: U$2.17 16.51,17.46 18.41,15.56 26.04,15.56 27.3,14.12 B2.~2 27.94,13.49 27.94,11.75 | U$7.P$4 27.94,11.75 | C6.2 27.94,11.75
OUTB2
  Top 0.305: 25.4,11.53 C6.1 | B2.~1 24.96,14.1 24.13,13.97
  Top 0.813: B2.~1 24.73,12.2 C6.1 | U$7.P$3 25.4,11.53 | U$2.16 15.24,16.51 17.78,13.97 24.13,13.97
PWMA
  Top 0.254: U$2.8 11.43,35.56 11.11,35.88 11.11,37.78 10.79,38.1 5.4,38.1 4.76,37.47 4.76,31.11 4.13,30.48 U$1.D9
PWMB
  Top 0.254: U$2.14 12.7,22.86 12.38,23.18 6.99,23.18 5.4,24.77 5.4,26.99 4.45,27.94 U$1.D10
RST
  Top 0.254: U$1.RES 49.53,24.13 48.9,23.5 48.9,20.95 48.26,20.32 S1.3
RX
  Bottom 0.254: U$1.RX 7.62,54.61 8.26,53.98 8.26,41.91 6.67,40.32 6.67,13.02 7.3,12.38 10.48,12.38 11.11,11.75 JP7.3
SCK  (via drill 0.6)
  Top 0.203: U$4.5 22.23,45.72 21.59,46.35 15.56,46.35 14.92,45.72 U$3.5 6.99,45.72 6.67,45.4 v6.67,44.77
  Top 0.254: SPI.6 3.49,6.99 5.4,8.89 5.4,19.68 4.76,20.32 U$1.D13
  Bottom 0.254: U$1.D13 4.76,20.32 5.4,20.95 5.4,40.96 6.67,42.23 v6.67,44.77
SCL
  Bottom 0.254: U$1.A5 46.35,54.61 45.4,53.66 45.4,31.75 44.77,31.11 44.77,17.14 45.4,16.51 TWI.3
SDA
  Bottom 0.254: U$1.A4 47.31,52.07 46.04,50.8 46.04,31.43 45.4,30.8 45.4,17.78 46.04,17.14 46.99,17.14 47.94,16.19 TWI.4
SNA
  Top 0.203: 26.35,29.53 IC1.3
  Top 0.254: U$2.2 19.05,33.34 19.37,33.02 22.54,33.02 23.81,31.75 23.81,29.53 24.45,28.89 25.72,28.89 26.35,29.53
  Top 0.406: U$2.2 19.05,36.2 19.68,36.83 R7.2
SNB
  Top 0.203: 25.08,24.45 IC1.5 | 19.05,18.52 R8.1
  Top 0.254: U$2.19 19.05,22.54 19.37,22.86 21.91,22.86 23.5,24.45 25.08,24.45
  Top 0.406: U$2.19 19.05,18.52
SS1
  Top 0.203: U$1.D4 3.81,44.45 4.45,45.09 4.45,46.35 5.08,46.99 U$3.4
SS2
  Top 0.203: U$4.4 24.77,46.99 23.5,48.26 22.23,48.26 21.59,47.62 15.88,47.62 14.61,46.35 5.4,46.35 5.08,46.04 5.08,45.09 2.54,42.55 U$1.D5
TX
  Bottom 0.254: U$1.TX 6.99,52.07 7.62,51.44 7.62,42.23 6.03,40.64 6.03,11.75 6.86,10.92 JP7.4
VIN  (via drill 0.6)
  Top 0.254: C10.2 40.64,36.83 | C9.+ 35.25,36.83 35.24,36.83
  Top 0.406: VIN_ENABLE.1 40.64,36.83 35.24,36.83 33.66,36.83 31.75,38.73 14.61,38.73 13.97,38.1 v13.97,36.51 | 33.81,20.32 B1.+
  Top 0.813: v13.97,36.51 U$2.6 | U$7.P$1 20.32,3.17 20.95,2.54 34.92,2.54 35.56,3.17 35.56,19.68 34.92,20.32 33.81,20.32 | B2.+ 27.34,19.34 28.26,18.41 32.7,18.41 33.69,19.4 B1.+
  Bottom 0.813: U$7.P$1 20.32,21.91 19.68,22.54 15.56,22.54 14.61,23.5 14.61,31.75 13.97,32.38 v13.97,36.51

### Text on the board
tNames: V | V | A | A | B | B | I | I | G | G | | | | | Reset | | | GND | 5V | SDA | SCL | RX | TX | 5V | GND | | | Vin | GND | B2 | B1 | A2 | A1 | | | SCK | MISO | MOSI | D3 | 5V | GND | | | | | GND | 5V | SIG